# EAGLE design bbf-europower (EAGLE 7.2.0)
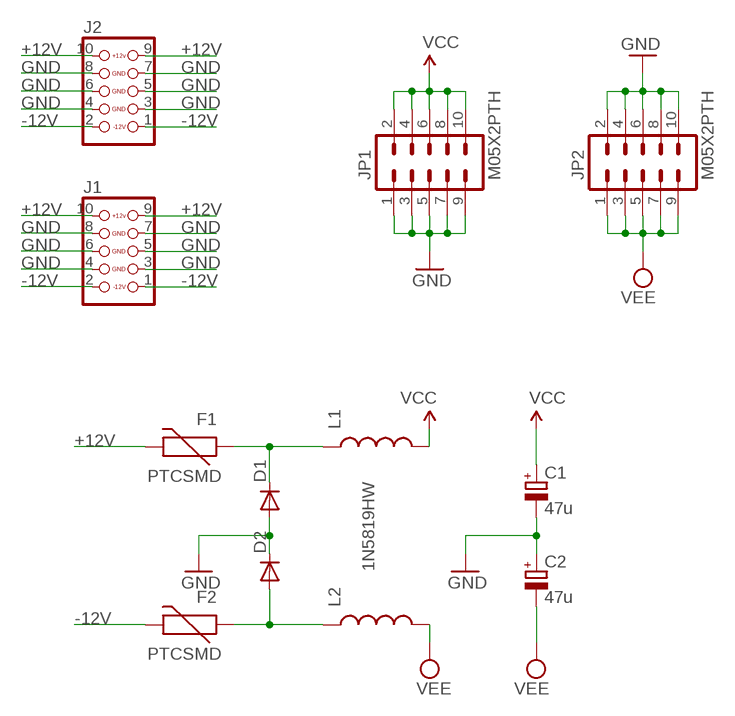
[diagram p0: schematic, sheet 1]

## Parts
C1  47u  CPOL-EUE2-5  [E2-5]
C2  47u  CPOL-EUE2-5  [E2-5]
D1  1N5819HW  DIODE-SOD123  [SOD123]
D2  1N5819HW  DIODE-SOD123  [SOD123]
F1  PTCSMD  [PTC-1206]
F2  PTCSMD  [PTC-1206]
J1  CON_HEADER_2X05-PTH  [M2X5]
J2  CON_HEADER_2X05-PTH  [M2X5]
JP1  M05X2PTH  [AVR_ICSP]
JP2  M05X2PTH  [AVR_ICSP]
L1  INDUCTOR0603  [0603]
L2  INDUCTOR0603  [0603]

## Nets
+12V: F1.2 J1.9 J1.10 J2.9 J2.10
-12V: F2.2 J1.1 J1.2 J2.1 J2.2
GND: C1.- C2.+ D1.A D2.C J1.3 J1.4 J1.5 J1.6 J1.7 J1.8 J2.3 J2.4 J2.5 J2.6 J2.7 J2.8 JP1.1 JP1.3 JP1.5 JP1.7 JP1.9 JP2.2 JP2.4 JP2.6 JP2.8 JP2.10
N$38: D1.C F1.1 L1.1
N$39: D2.A F2.1 L2.1
VCC: C1.+ JP1.2 JP1.4 JP1.6 JP1.8 JP1.10 L1.2
VEE: C2.- JP2.1 JP2.3 JP2.5 JP2.7 JP2.9 L2.2

## Library data of the parts
C1 C2 = resistor:CPOL-EU: POLARIZED CAPACITOR, European symbol
D1 D2 = diode:DIODE-: DIODE
F1 F2 = SparkFun:PTC: Resettable Fuse PTC Resettable Fuse. Spark Fun Electronics SKU : COM-08357
J1 J2 = tomatek:CON_HEADER_2X05: 2x05 pin header
JP1 JP2 = SparkFun:M05X2: Header 5x2 Standard 10-pin dual row 0.1" header. Commonly used with AVR-ISP. Use with Spark Fun Electronics SKU: PRT-00778
L1 L2 = SparkFun-Passives:INDUCTOR: Inductors Basic Inductor/Choke - 0603 and 1206. Footprints are not proven and vary greatly between part numbers. INDUCTOR POWER 3.3UH 4.0A SMD 0.197" L x 0.197" W x 0.177" H (5.00mm x 5.00mm x 4.50mm)

## Board
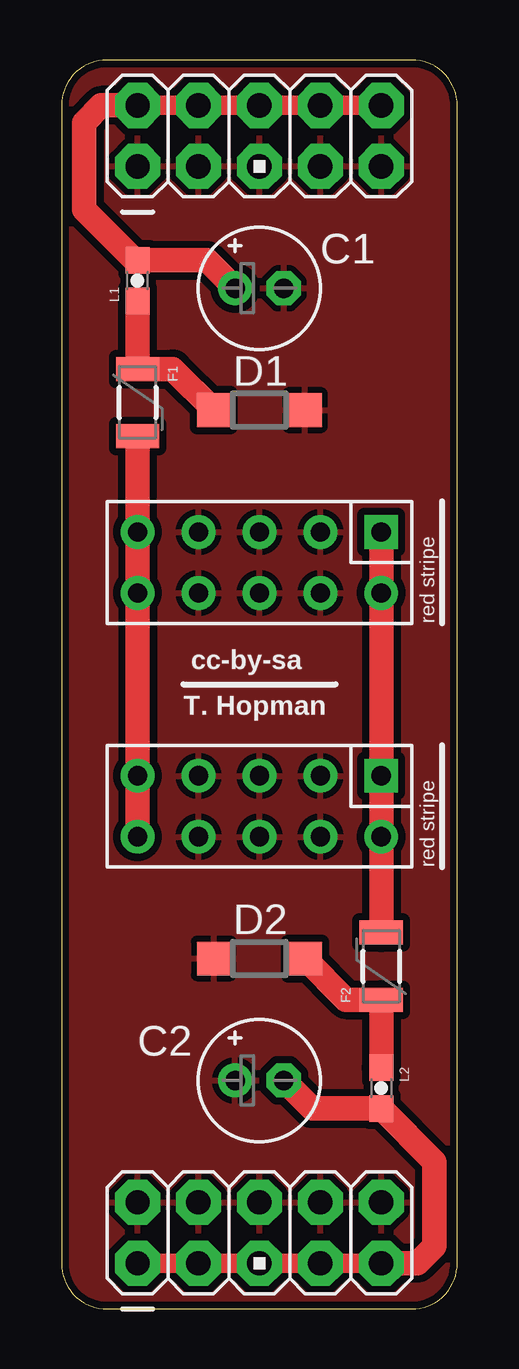
[diagram p1: board, top side]
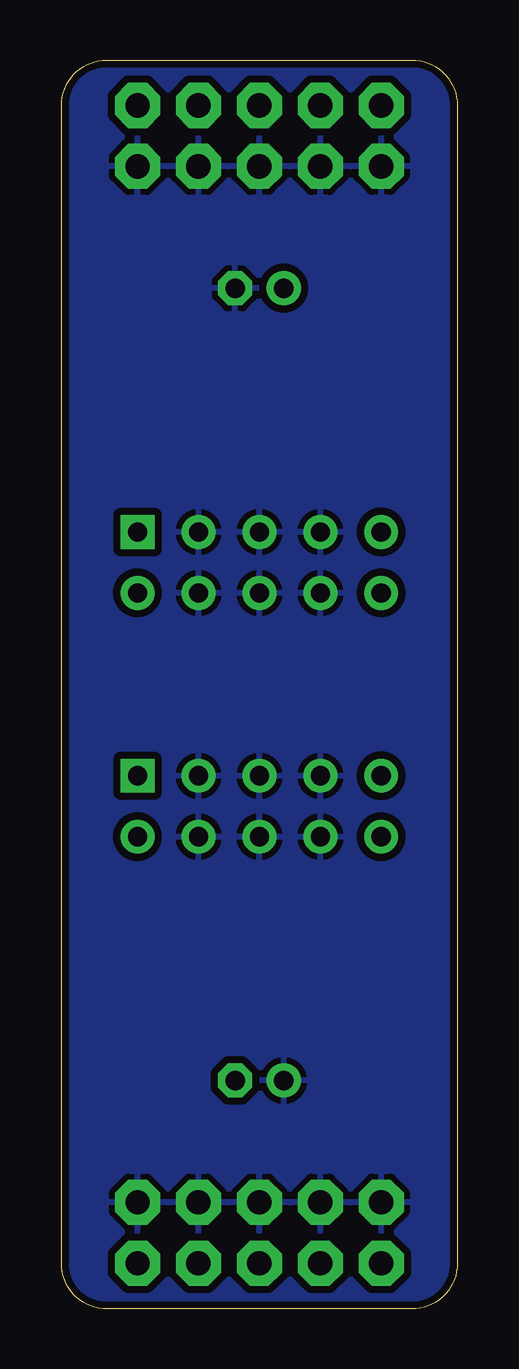
[diagram p2: board, bottom side, seen from below]

Size 16.51 x 52.06 mm. Coordinates in mm from the lower left corner, seen from the top.
Outline: 14.61,0 arc90 16.51,1.91 16.51,50.16 arc90 14.62,52.06 1.9,52.06 arc90 0,50.16 0,1.91 arc90 1.91,0 14.61,0
Copper layers (1*16): Top 0.035mm / dielectric 1.5mm / Bottom 0.035mm
Design rules "SparkFun_10mil *": minimum track width 8mil, minimum drill 20mil, track to track 8mil, track to pad 8mil, pad to pad 8mil, via to via 8mil, smd to smd 8mil, copper to edge 8mil, drill to drill 8mil, minimum pad ring 12mil, minimum via ring 10mil, stop-mask expansion 4mil, vias tented up to drill 25mil, thermal gap 10mil

### Footprints (pad centres in the part's own frame; a part is rotated, then mirrored left to right if it is on the bottom)
E2-5 = drill 0.813 pad 1.27: + -1.016,0 | drill 0.813 pad 1.27 octagon: - 1.016,0
SOD123 = smd 1.4 x 1.4: A 1.9,0; C -1.9,0
PTC-1206 = smd 1 x 1.8: 1 -1.4,0; 2 1.4,0
M2X5 = drill 0.8 square: 1 -5.08,-1.27 | drill 0.8: 2 -5.08,1.27; 3 -2.54,-1.27; 4 -2.54,1.27; 5 0,-1.27; 6 0,1.27; 7 2.54,-1.27; 8 2.54,1.27; 9 5.08,-1.27; 10 5.08,1.27
AVR_ICSP = drill 1.016 pad 1.88 octagon: 1 -1.27,5.08; 2 1.27,5.08; 3 -1.27,2.54; 4 1.27,2.54; 5 -1.27,0; 6 1.27,0; 7 -1.27,-2.54; 8 1.27,-2.54; 9 -1.27,-5.08; 10 1.27,-5.08
0603 = smd 1.1 x 1: 1 -0.85,0; 2 0.85,0

### Placement (x,y rotation side)
C1  8.26,42.55 0 top
C2  8.26,9.53 0 top
D1  8.26,37.47 0 top
D2  8.26,14.61 0 top
F1  3.17,37.78 270 top
F2  13.34,14.29 90 top
J1  8.26,31.11 180 top
J2  8.26,20.95 180 top
JP1  8.26,48.9 90 top
JP2  8.26,3.17 90 top
L1  3.17,42.86 90 top
L2  13.34,9.21 270 top

### Tracks (layer width: path | path; a pad name or v marks a point on that pad's centre or on a via)
+12V
  Top 1.016: F1.2 J1.9 J1.10 J2.9 J2.10
-12V
  Top 1.016: J1.1 J1.2 J2.1 J2.2 F2.2
GND
  pour Bottom (isolate 0.305): 14.61,0 arc90 16.51,1.91 16.51,50.16 arc90 14.61,52.07 1.91,52.07 arc90 0,50.16 0,1.91 arc90 1.91,0
  pour Top (isolate 0.305): 14.61,0 arc90 16.51,1.91 16.51,50.16 arc90 14.61,52.07 1.91,52.07 arc90 0,50.16 0,1.91 arc90 1.91,0
N$38
  Top 1.016: L1.1 F1.1 4.64,39.18 D1.C
N$39
  Top 1.016: L2.1 F2.1 11.87,12.89 D2.A
VCC
  Top 0.813: JP1.2 JP1.4 JP1.6 JP1.8 JP1.10
  Top 1.016: JP1.2 1.66,50.16 0.95,49.45 0.95,45.81 3.05,43.71 L1.2 6.07,43.71 C1.+
VEE
  Top 0.813: JP2.1 JP2.3 JP2.5 JP2.7 JP2.9
  Top 1.016: JP2.9 14.85,1.91 15.56,2.62 15.56,6.13 L2.2 10.44,8.36 C2.-

### Text on the board
tNames: red stripe | cc-by-sa | T. Hopman | red stripe